# Altium project PNEV5180B_V2.0.PrjPCB
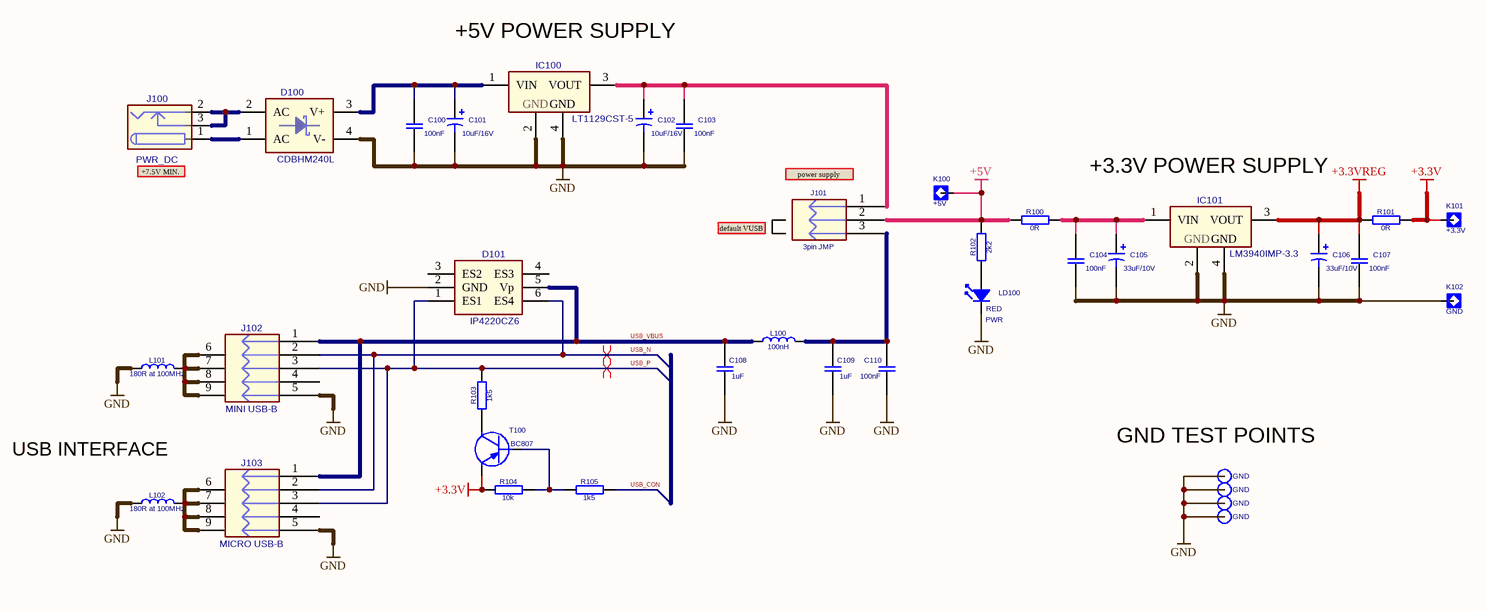
[diagram p0: Power Supply.SchDoc]
Date: 14.09.2015; Designed_by: ELTIV Bostjan Stumpfel s.p.; Revision: V2.0; Title: PNEV5180B
3 sheets, 219 parts. Net scope: global (net labels, ports and power ports of the same name join across sheets).
Board files: PNEV5180B_V2.0.PcbDoc, PNEV5180B_V2.0 - Panel.PcbDoc
Sheets:
  Power Supply.SchDoc
  Processor.SchDoc
  Reader_PN5108.SchDoc

## Sheet Power Supply.SchDoc: PNEV5180B
size A3; Date: 15.9.2015; DrawnBy: GVR; Address1: A3; Revision: 2.0; SheetNumber: 1; SheetTotal: 3

### Parts
(Parts that share a designator on the sheet are numbered #1, #2 ... from top to bottom, then left to right.)
?#1  (no value)
C100  100nF  [Y0603]
C101  10uF/16V  [CAP_TANT_1206_CASE-A]
C102  10uF/16V  [CAP_TANT_1206_CASE-A]
C103  100nF  [Y0603]
C104  100nF  [Y0603]
C105  33uF/10V  [C_TANTAL_B]
C106  33uF/10V  [C_TANTAL_B]
C107  100nF  [Y0603]
C108  1uF  [Y0603]
C109  1uF  [Y0603]
C110  100nF  [Y0603]
D100  CDBHM240L  [GRETZ_MBS2]
D101  IP4220CZ6  [SOT-457]
IC100  LT1129CST-5  [SOT-223-3]
IC101  LM3940IMP-3.3  [SOT-223-3]
J100  value PWR_DC  [CON_JCK_2.5mm]  (hidden comment: PWR_DC_PJ-202A)
J101  3pin JMP  [CON3M-LINE]
J102  MINI USB-B  [CON_USB-B-MINI_SD-67503-010_5075BMR-05-SM-CR]
J103  MICRO USB-B  [CON_USB_MICRO_B_WE-629 105 136 821]
K100  value +5V  [TESTP_ROUND_1.0mm]  (hidden comment: TP1)
K101  value +3.3V  [TESTP_ROUND_1.0mm]  (hidden comment: TP1)
K102  value GND  [TESTP_ROUND_1.0mm]  (hidden comment: TP1)
K103  value GND  [CON1_PIN_Round_1.0x1.8mm]  (hidden comment: TP_1.0mm)
K104  value GND  [CON1_PIN_Round_1.0x1.8mm]  (hidden comment: TP_1.0mm)
K105  value GND  [CON1_PIN_Round_1.0x1.8mm]  (hidden comment: TP_1.0mm)
K106  value GND  [CON1_PIN_Round_1.0x1.8mm]  (hidden comment: TP_1.0mm)
L100  100nH  [INDCC_1812]
L101  value 180R at 100MHz  [Y0603]  (hidden comment: BLM18PG181SN1)
L102  value 180R at 100MHz  [Y0603]  (hidden comment: BLM18PG181SN1)
LD100  RED  [LED_0603]
R100  0R  [Y0603]
R101  0R  [Y0603]
R102  2k2  [Y0603]
R103  1k5  [Y0603]
R104  10k  [Y0603]
R105  1k5  [Y0603]
T100  BC807  [SOT-23]

### Nets
+3.3V: K101.1 R101.1 R104.2 T100.2(E)
+3.3VREG: C106.1 C107.1 IC101.3(VOUT) R101.2
+5V: J101.2(P2) K100.1 R100.2 R102.2
GND: C100.2 C101.2 C102.2 C103.2 C104.2 C105.2 C106.2 C107.2 C108.2 C109.2 C110.2 D100.4(V-) D101.2(GND) IC100.2(GND) IC100.4(GND) IC101.2(GND) IC101.4(GND) J102.5(GND) J103.5(GND) K102.1 K103.1 K104.1 K105.1 K106.1 L101.1 L102.1 LD100.1
USB_CON: R105.1
USB_N: D101.6(ES4) J102.2(D-) J103.2(D-)
USB_P: D101.1(ES1) J102.3(D+) J103.3(D+) R103.1
USB_VBUS: C108.1 D101.5(Vp) J102.1(VBUS) J103.1(VBUS) L100.1
NetC100_1: C100.1 C101.1 D100.3(V+) IC100.1(VIN)
NetC102_1: C102.1 C103.1 IC100.3(VOUT) J101.1(P1)
NetC104_1: C104.1 C105.1 IC101.1(VIN) R100.1
NetC109_1: C109.1 C110.1 J101.3(P3) L100.2
NetD100_1: D100.1(AC) J100.1
NetD100_2: D100.2(AC) J100.2 J100.3
NetJ102_6: J102.6(Case1) J102.7(Case2) J102.8(Case3) J102.9(Case4) L101.2
NetJ103_6: J103.6(Case1) J103.7(Case2) J103.8(Case3) J103.9(Case4) L102.2
NetLD100_2: LD100.2 R102.1
NetR103_2: R103.2 T100.3(C)
NetR104_1: R104.1 R105.2 T100.1(B)

Not connected (* = marked no-connect by the designer): D101 3(ES2) 4(ES3); J102 4(ID); J103 4(ID)

### Layout directives
differential pair: USB_N, USB_P

### Notes on the sheet
- (near IC100) +5V POWER SUPPLY
- (near J100) +7.5V MIN.
- (near J101) power supply jumper
- +3.3V POWER SUPPLY
- default VUSB
- (near L102) USB INTERFACE
- GND TEST POINTS
- Title:
- Date:
- File:
- Revision:
- Drawn By:
- Sheet:
- Paper Size:
- of
- (in symbol LEDY0603) PWR

### Library data of the parts
?#1 = Title Block NXP
C100 C103 C104 C107-C110 = CAPC0603
  C100 C103 C104 C107 C110: Value: 100nF
  C108 C109: Value: 1uF
C101 C102 = C_TANTAL_1206: DNP: DNP; Value: 10uF/16V
C105 C106 = C_TANTAL_B: DNP: DNP; Value: 33uF/10V
D100 = GRETZ_MBS2: GRETZ_MBS2_Schottky; DNP: DNP; Value: CDBHM240L
D101 = D_IP4220CZ6: Value: IP4220CZ6
IC100 = LM3940-3.3: also for: LT1129IST-5; DNP: DNP; Value: LT1129CST-5
IC101 = LM3940-3.3: DNP: DNP; Value: LM3940IMP-3.3
J100 = CON_JCK_2.5mm: PWR_JACK_2.1mm x 5.5mm; DigiKey: PJ-202A; DNP: DNP
J101 = CON3M_LINE
J102 = CON_USB_B_RA: Value: 548190572 (DigiKey); Value: 675031020 (DigiKey); also for: 5075BMR-05-SM-CR (IC-Elektronika)
J103 = CON_USB_MICRO_B: Value: 629105136821 (Wurth); DNP: DNP
L100 = INDC1812: Value: 100nH
L101 L102 = INDC0603: DNP: DNP; Value: BLM18PG181SN1
LD100 = LEDY0603: Value: RED; DNP: DNP
R100-R105 = RESC0603
  R100 R101: Value: 0R
  R102: Value: 2k2
  R103 R105: Value: 1k5
  R104: Value: 10k
K103-K106 = TP_1.0mm: DNP: DNP

## Sheet Processor.SchDoc: PNEV5180B
size A3; Date: 15.9.2015; DrawnBy: GVR; Address1: A3; Revision: 2.0; SheetNumber: 2; SheetTotal: 3
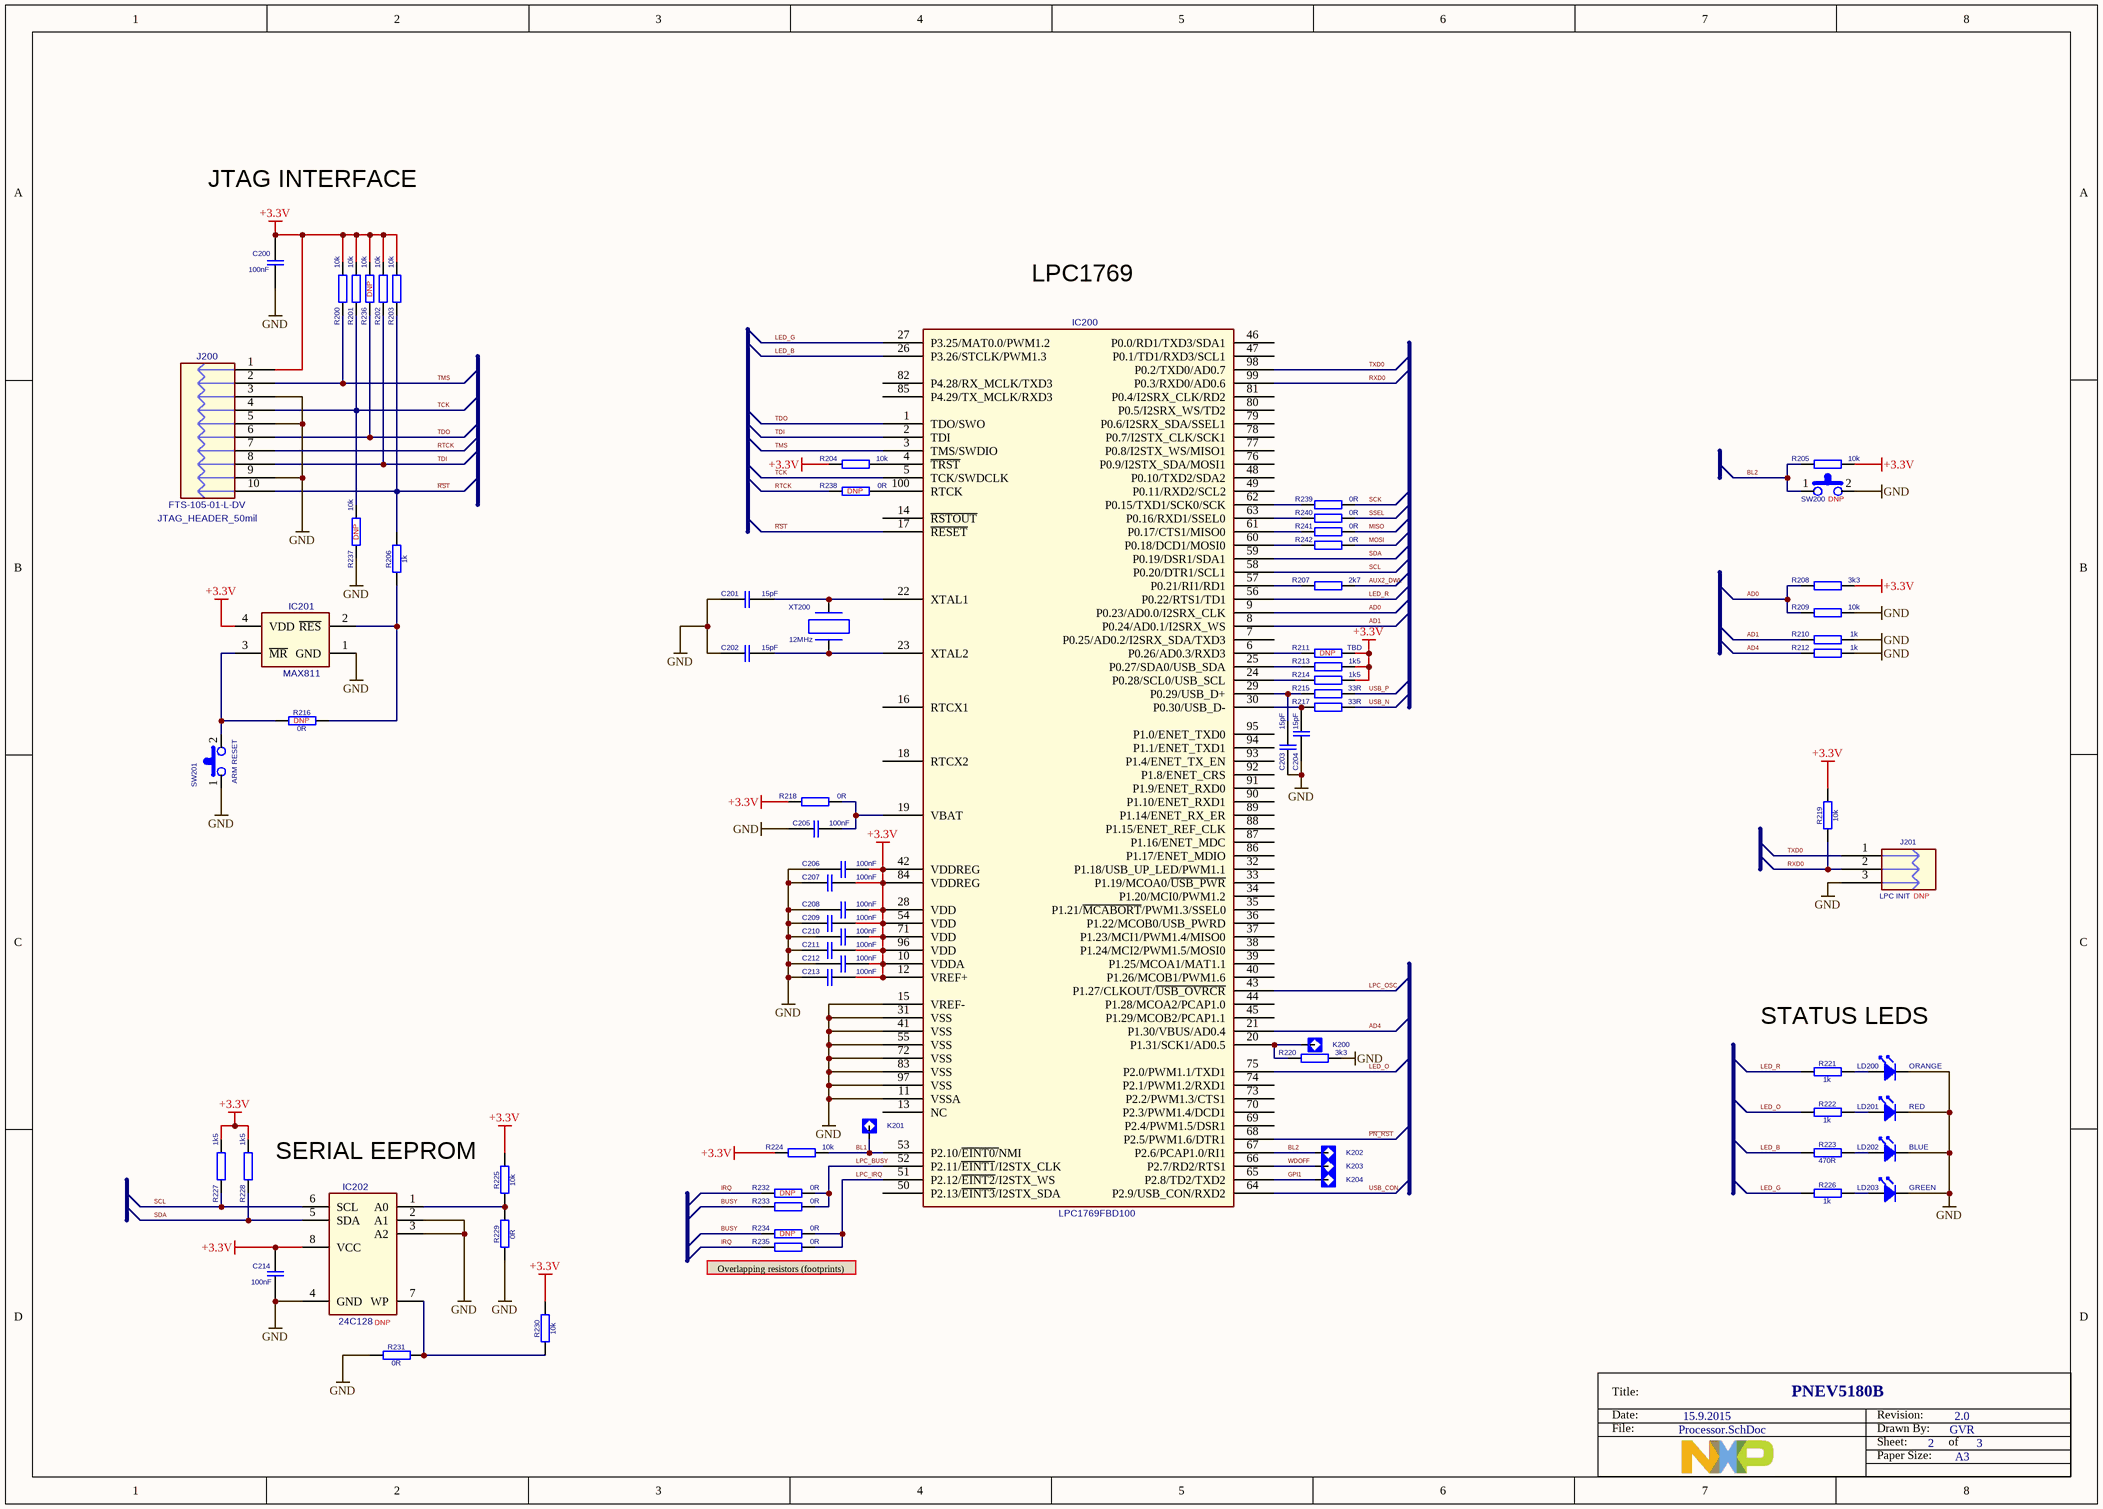
[diagram p1: Processor.SchDoc]

### Parts
(Parts that share a designator on the sheet are numbered #1, #2 ... from top to bottom, then left to right.)
?#2  (no value)
C200  100nF  [Y0603]
C201  15pF  [Y0603]
C202  15pF  [Y0603]
C203  15pF  [Y0603]
C204  15pF  [Y0603]
C205  100nF  [Y0402]
C206  100nF  [Y0402]
C207  100nF  [Y0402]
C208  100nF  [Y0402]
C209  100nF  [Y0402]
C210  100nF  [Y0402]
C211  100nF  [Y0402]
C212  100nF  [Y0402]
C213  100nF  [Y0402]
C214  100nF  [Y0603]
IC200  LPC1769FBD100  [TSQFP50P1600X1600X160-100N]
IC201  MAX811  [SOT143B]
IC202  value 24C128  [SOIC8]  (hidden comment: 24C128 DNP)
J200  FTS-105-01-L-DV  [CON_FTS-105-01-L-DV]
J201  value LPC INIT  [CON3M-LINE]  (hidden comment: LPC INIT DNP)
K200  TP1  [TESTP_ROUND_1.0mm]  (value not drawn)
K201  TP1  [TESTP_ROUND_1.0mm]  (value not drawn)
K202  TP1  [TESTP_ROUND_1.0mm]  (value not drawn)
K203  TP1  [TESTP_ROUND_1.0mm]  (value not drawn)
K204  TP1  [TESTP_ROUND_1.0mm]  (value not drawn)
LD200  ORANGE  [LED_0603]
LD201  RED  [LED_0603]
LD202  BLUE  [LED_0603]
LD203  GREEN  [LED_0603]
R200  10k  [Y0603]
R201  10k  [Y0603]
R202  10k  [Y0603]
R203  10k  [Y0603]
R204  10k  [Y0603]
R205  10k  [Y0603]
R206  1k  [Y0603]
R207  2k7  [Y0603]
R208  3k3  [Y0603]
R209  10k  [Y0603]
R210  1k  [Y0603]
R211  value TBD  [Y0603]  (hidden comment: TBD DNP)
R212  1k  [Y0603]
R213  1k5  [Y0603]
R214  1k5  [Y0603]
R215  33R  [Y0603]
R216  value 0R  [Y0603]  (hidden comment: 0R DNP)
R217  33R  [Y0603]
R218  0R  [Y0603]
R219  10k  [Y0603]
R220  3k3  [Y0603]
R221  1k  [Y0603]
R222  1k  [Y0603]
R223  470R  [Y0603]
R224  10k  [Y0603]
R225  10k  [Y0603]
R226  1k  [Y0603]
R227  1k5  [Y0603]
R228  1k5  [Y0603]
R229  0R  [Y0603]
R230  10k  [Y0603]
R231  0R  [Y0603]
R232  value 0R  [Y0805]  (hidden comment: 0R DNP)
R233  0R  [Y0805]
R234  value 0R  [Y0805]  (hidden comment: 0R DNP)
R235  0R  [Y0805]
R236  value 10k  [Y0603]  (hidden comment: 10k DNP)
R237  value 10k  [Y0603]  (hidden comment: 10k DNP)
R238  value 0R  [Y0603]  (hidden comment: 0R DNP)
R239  0R  [Y0402]
R240  0R  [Y0402]
R241  0R  [Y0402]
R242  0R  [Y0402]
SW200  DTSM-32S-B DNP  [SW_DTSM-32S-B]  (value not drawn)
SW201  DTSM-32S-B  [SW_DTSM-32S-B]  (value not drawn)
XT200  12MHz  [QUARTZ_NX5032GA]

### Nets
+3.3V: C200.1 C206.2 C207.2 C208.2 C209.2 C210.2 C211.2 C212.2 C213.2 C214.2 IC200.10(VDDA) IC200.12(VREF+) IC200.28(VDD) IC200.42(VDDREG) IC200.54(VDD) IC200.71(VDD) IC200.84(VDDREG) IC200.96(VDD) IC201.4(VDD) IC202.8(VCC) J200.1 R200.2 R201.2 R202.2 R203.2 R204.2 R205.1 R208.1 R211.1 R213.1 R214.1 R218.2 R219.2 R224.2 R225.1 R227.1 R228.1 R230.1 R236.2
GND: C200.2 C201.2 C202.2 C203.1 C204.1 C205.1 C206.1 C207.1 C208.1 C209.1 C210.1 C211.1 C212.1 C213.1 C214.1 IC200.11(VSSA) IC200.15(VREF-) IC200.31(VSS) IC200.41(VSS) IC200.55(VSS) IC200.72(VSS) IC200.83(VSS) IC200.97(VSS) IC201.1(GND) IC202.2(A1) IC202.3(A2) IC202.4(GND) J200.3 J200.5 J200.9 J201.3(P3) LD200.1 LD201.1 LD202.1 LD203.1 R209.1 R210.1 R212.1 R220.1 R229.2 R231.2 R237.1 SW200.2 SW201.1
AD0: IC200.9(P0.23/AD0.0/I2SRX_CLK) R208.2 R209.2
AD1: IC200.8(P0.24/AD0.1/I2SRX_WS) R210.2
AD4: IC200.21(P1.30/VBUS/AD0.4) R212.2
AUX2_DWL: R207.1
BL1: IC200.53(P2.10/~{EINT0/}NMI) K201.1 R224.1
BL2: IC200.67(P2.6/PCAP1.0/RI1) K202.1 R205.2 SW200.1
BUSY: R233.1 R234.1
GPI1: IC200.65(P2.8/TD2/TXD2) K204.1
IRQ: R232.1 R235.1
LED_B: IC200.26(P3.26/STCLK/PWM1.3) R223.1
LED_G: IC200.27(P3.25/MAT0.0/PWM1.2) R226.1
LED_O: IC200.75(P2.0/PWM1.1/TXD1) R222.1
LED_R: IC200.56(P0.22/RTS1/TD1) R221.1
LPC_BUSY: IC200.52(P2.11/~{EINT1}/I2STX_CLK) R232.2 R233.2
LPC_IRQ: IC200.51(P2.12/~{EINT2}/I2STX_WS) R234.2 R235.2
LPC_OSC: IC200.43(P1.27/CLKOUT/~{USB_OVRCR})
MISO: R241.1
MOSI: R242.1
~{PN_RST}: IC200.68(P2.5/PWM1.6/DTR1)
~{RST}: IC200.17(~{RESET}) J200.10 R203.1 R206.2
RTCK: J200.7 R238.2
RXD0: IC200.99(P0.3/RXD0/AD0.6) J201.2(P2) R219.1
SCK: R239.1
SCL: IC200.58(P0.20/DTR1/SCL1) IC202.6(SCL) R227.2
SDA: IC200.59(P0.19/DSR1/SDA1) IC202.5(SDA) R228.2
SSEL: R240.1
TCK: IC200.5(TCK/SWDCLK) J200.4 R201.1 R237.2
TDI: IC200.2(TDI) J200.8 R202.1
TDO: IC200.1(TDO/SWO) J200.6 R236.1
TMS: IC200.3(TMS/SWDIO) J200.2 R200.1
TXD0: IC200.98(P0.2/TXD0/AD0.7) J201.1(P1)
USB_CON: IC200.64(P2.9/USB_CON/RXD2)
USB_N: R217.1
USB_P: R215.1
WDOFF: IC200.66(P2.7/RD2/RTS1) K203.1
NetC201_1: C201.1 IC200.22(XTAL1) XT200.2
NetC202_1: C202.1 IC200.23(XTAL2) XT200.1
NetC203_2: C203.2 IC200.29(P0.29/USB_D+) R215.2
NetC204_2: C204.2 IC200.30(P0.30/USB_D-) R217.2
NetC205_2: C205.2 IC200.19(VBAT) R218.1
NetIC200_4: IC200.4(~{TRST}) R204.1
NetIC200_6: IC200.6(P0.26/AD0.3/RXD3) R211.2
NetIC200_20: IC200.20(P1.31/SCK1/AD0.5) K200.1 R220.2
NetIC200_24: IC200.24(P0.28/SCL0/USB_SCL) R214.2
NetIC200_25: IC200.25(P0.27/SDA0/USB_SDA) R213.2
NetIC200_57: IC200.57(P0.21/RI1/RD1) R207.2
NetIC200_60: IC200.60(P0.18/DCD1/MOSI0) R242.2
NetIC200_61: IC200.61(P0.17/CTS1/MISO0) R241.2
NetIC200_62: IC200.62(P0.15/TXD1/SCK0/SCK) R239.2
NetIC200_63: IC200.63(P0.16/RXD1/SSEL0) R240.2
NetIC200_100: IC200.100(RTCK) R238.1
NetIC201_2: IC201.2(~{RES}) R206.1 R216.2
NetIC201_3: IC201.3(~{MR}) R216.1 SW201.2
NetIC202_1: IC202.1(A0) R225.2 R229.1
NetIC202_7: IC202.7(WP) R230.2 R231.1
NetLD200_2: LD200.2 R221.2
NetLD201_2: LD201.2 R222.2
NetLD202_2: LD202.2 R223.2
NetLD203_2: LD203.2 R226.2

Not connected (* = marked no-connect by the designer): IC200 7(P0.25/AD0.2/I2SRX_SDA/TXD3) 13(NC) 14(~{RSTOUT}) 16(RTCX1) 18(RTCX2) 32(P1.18/USB_UP_LED/PWM1.1) 33(P1.19/MCOA0/~{USB_PWR}) 34(P1.20/MCI0/PWM1.2) 35(P1.21/~{MCABORT}/PWM1.3/SSEL0) 36(P1.22/MCOB0/USB_PWRD) 37(P1.23/MCI1/PWM1.4/MISO0) 38(P1.24/MCI2/PWM1.5/MOSI0) 39(P1.25/MCOA1/MAT1.1) 40(P1.26/MCOB1/PWM1.6) 44(P1.28/MCOA2/PCAP1.0) 45(P1.29/MCOB2/PCAP1.1) 46(P0.0/RD1/TXD3/SDA1) 47(P0.1/TD1/RXD3/SCL1) 48(P0.10/TXD2/SDA2) 49(P0.11/RXD2/SCL2) 50(P2.13/~{EINT3}/I2STX_SDA) 69(P2.4/PWM1.5/DSR1) 70(P2.3/PWM1.4/DCD1) 73(P2.2/PWM1.3/CTS1) 74(P2.1/PWM1.2/RXD1) 76(P0.9/I2STX_SDA/MOSI1) 77(P0.8/I2STX_WS/MISO1) 78(P0.7/I2STX_CLK/SCK1) 79(P0.6/I2SRX_SDA/SSEL1) 80(P0.5/I2SRX_WS/TD2) 81(P0.4/I2SRX_CLK/RD2) 82(P4.28/RX_MCLK/TXD3) 85(P4.29/TX_MCLK/RXD3) 86(P1.17/ENET_MDIO) 87(P1.16/ENET_MDC) 88(P1.15/ENET_REF_CLK) 89(P1.14/ENET_RX_ER) 90(P1.10/ENET_RXD1) 91(P1.9/ENET_RXD0) 92(P1.8/ENET_CRS) 93(P1.4/ENET_TX_EN) 94(P1.1/ENET_TXD1) 95(P1.0/ENET_TXD0)

### Notes on the sheet
- JTAG INTERFACE
- LPC1769
- STATUS LEDS
- SERIAL EEPROM
- (near R235) Overlapping resistors (footprints)
- Title:
- Date:
- File:
- Revision:
- Drawn By:
- Sheet:
- Paper Size:
- of
- (in symbol CON_JTAG_PINS) JTAG_HEADER_50mil
- (in symbol SWITCH_SMD) ARM RESET

### Library data of the parts
?#2 = Title Block NXP
C200-C204 C214 = CAPC0603
  C200 C214: Value: 100nF
  C201-C204: Value: 15pF
C205-C213 = CAPC0402: Value: 100nF
IC200 = LPC176XFBD100: LQFP100; DNP: DNP; Value: LPC1769FBD100
IC202 = 24CXX: SERIAL EEPROM; DNP: DNP
J200 = CON_JTAG_PINS: 50mil, 2x5 pin (M), SMD; DNP: DNP; Value: FTS-105-01-L-DV
J201 = CON3M_LINE: DNP: DNP
LD200-LD203 = LEDY0603: DNP: DNP
  LD200: Value: ORANGE
  LD201: Value: RED
  LD202: Value: BLUE
  LD203: Value: GREEN
R200-R231 R236-R238 = RESC0603
  R200-R205 R209 R219 R224 R225 R230: Value: 10k
  R206 R210 R212 R221 R222 R226: Value: 1k
  R207: Value: 2k7; DNP: DNP
  R208 R220: Value: 3k3
  R211 R216 R236-R238: DNP: DNP
  R213 R214 R227 R228: Value: 1k5
  R215 R217: Value: 33R
  R218 R231: Value: 0R
  R223: Value: 470R
  R229: DNP: DNP; Value: 0R
R232-R235 = RESC0805: DNP: DNP
  R233 R235: Value: 0R
R239-R242 = RESC0402: Value: 0R; DNP: DNP
SW200 = SWITCH_SMD: DTSM-32S-B; DNP: DNP; Value: DTSM-32S-B
SW201 = SWITCH_SMD: DNP: DNP; Value: DTSM-32S-B
XT200 = QUARTZ_NX5032: Value: 12MHz

## Sheet Reader_PN5108.SchDoc: PNEV5180B
size A3; Date: 15.9.2015; DrawnBy: GVR; Address1: A3; Revision: 2.0; SheetNumber: 3; SheetTotal: 3
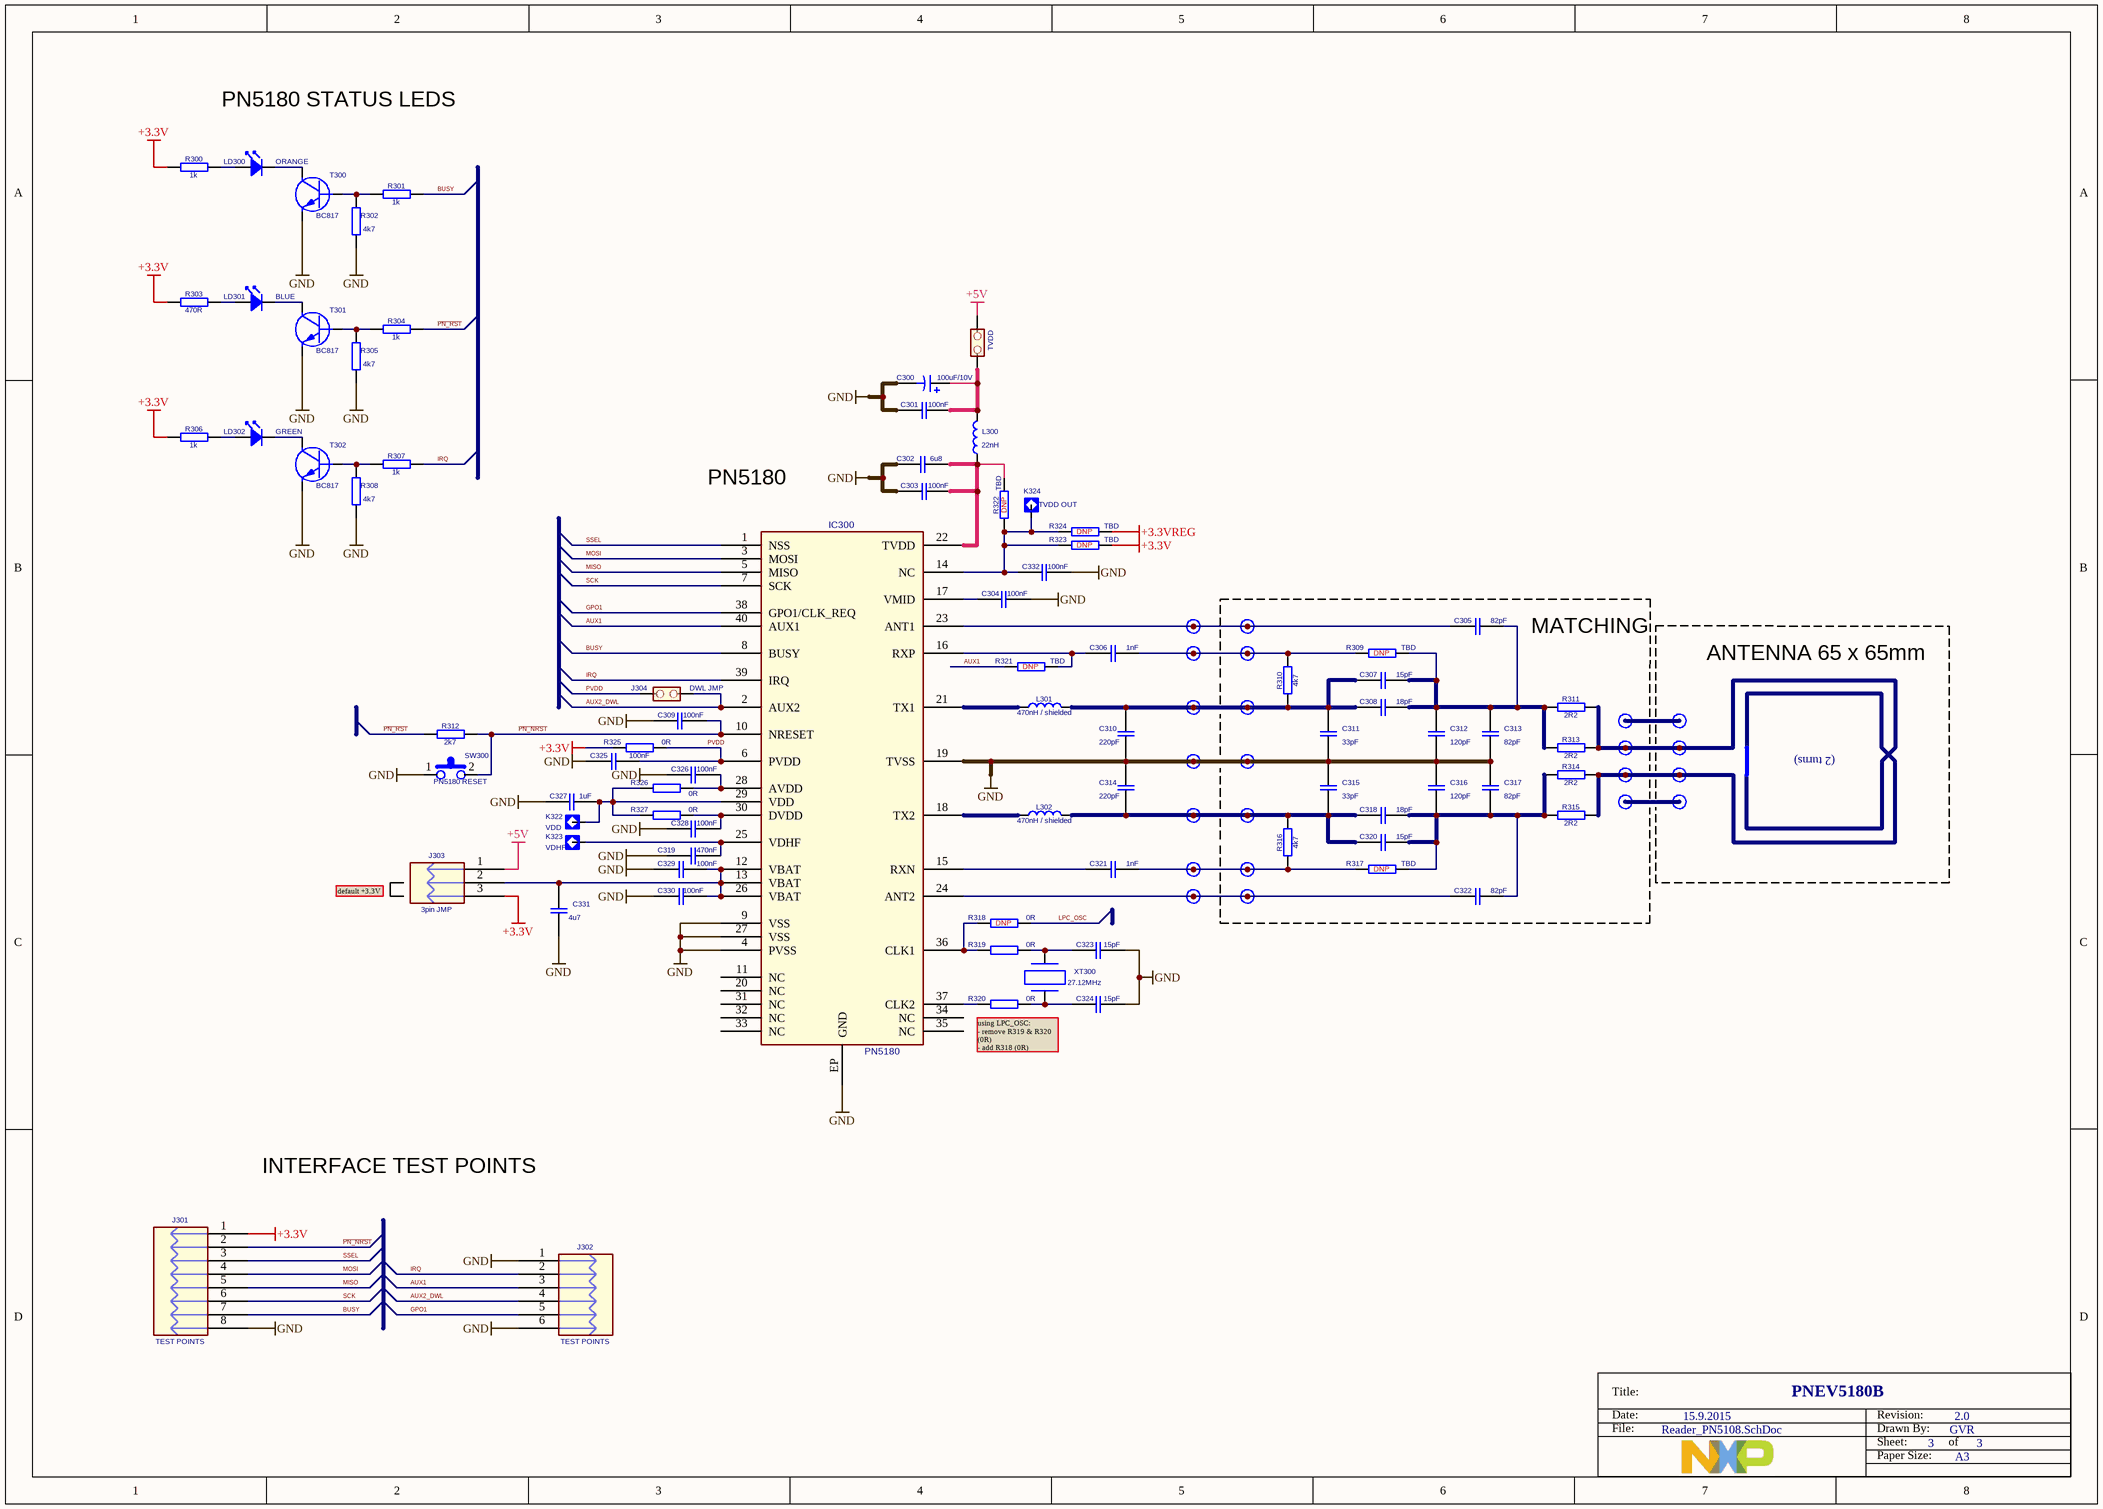
[diagram p2: Reader_PN5108.SchDoc]

### Parts
(Parts that share a designator on the sheet are numbered #1, #2 ... from top to bottom, then left to right.)
?#3  (no value)
C300  100uF/10V  [C_TANTAL_B]
C301  100nF  [Y0603]
C302  6u8  [Y0603]
C303  100nF  [Y0603]
C304  100nF  [Y0603]
C305  82pF  [Y0805]
C306  1nF  [Y0805]
C307  15pF  [Y0805]
C308  18pF  [Y0805]
C309  100nF  [Y0603]
C310  220pF  [Y0805]
C311  33pF  [Y0805]
C312  120pF  [Y0805]
C313  82pF  [Y0805]
C314  220pF  [Y0805]
C315  33pF  [Y0805]
C316  120pF  [Y0805]
C317  82pF  [Y0805]
C318  18pF  [Y0805]
C319  470nF  [Y0603]
C320  15pF  [Y0805]
C321  1nF  [Y0805]
C322  82pF  [Y0805]
C323  15pF  [Y0603]
C324  15pF  [Y0603]
C325  100nF  [Y0402]
C326  100nF  [Y0603]
C327  1uF  [Y0603]
C328  100nF  [Y0603]
C329  100nF  [Y0402]
C330  100nF  [Y0402]
C331  4u7  [Y0603]
C332  100nF  [Y0603]
IC300  PN5180  [QFN50P600X600X100_HS-41N]
J300  TVDD  [CON2]
J301  value TEST POINTS  [CON8M-LINE]  (hidden comment: CON8M_LINE)
J302  value TEST POINTS  [CON6M-LINE]  (hidden comment: CON6M_LINE)
J303  3pin JMP  [CON3M-LINE]
J304  DWL JMP  [CON2]
K300  TP_1.0mm  [CON1_PIN_Round_1.0x1.8mm]  (value not drawn)
K301  TP_1.0mm  [CON1_PIN_Round_1.0x1.8mm]  (value not drawn)
K302  TP_1.0mm  [CON1_PIN_Round_1.0x1.8mm]  (value not drawn)
K303  TP_1.0mm  [CON1_PIN_Round_1.0x1.8mm]  (value not drawn)
K304  TP_1.0mm  [CON1_PIN_Round_1.0x1.8mm]  (value not drawn)
K305  TP_1.0mm  [CON1_PIN_Round_1.0x1.8mm]  (value not drawn)
K306  TP_1.0mm  [CON1_PIN_Round_1.0x1.8mm]  (value not drawn)
K307  TP_1.0mm  [CON1_PIN_Round_1.0x1.8mm]  (value not drawn)
K308  TP_1.0mm  [CON1_PIN_Round_1.0x1.8mm]  (value not drawn)
K309  TP_1.0mm  [CON1_PIN_Round_1.0x1.8mm]  (value not drawn)
K310  TP_1.0mm  [CON1_PIN_Round_1.0x1.8mm]  (value not drawn)
K311  TP_1.0mm  [CON1_PIN_Round_1.0x1.8mm]  (value not drawn)
K312  TP_1.0mm  [CON1_PIN_Round_1.0x1.8mm]  (value not drawn)
K313  TP_1.0mm  [CON1_PIN_Round_1.0x1.8mm]  (value not drawn)
K314  TP_1.0mm  [CON1_PIN_Round_1.0x1.8mm]  (value not drawn)
K315  TP_1.0mm  [CON1_PIN_Round_1.0x1.8mm]  (value not drawn)
K316  TP_1.0mm  [CON1_PIN_Round_1.0x1.8mm]  (value not drawn)
K317  TP_1.0mm  [CON1_PIN_Round_1.0x1.8mm]  (value not drawn)
K318  TP_1.0mm  [CON1_PIN_Round_1.0x1.8mm]  (value not drawn)
K319  TP_1.0mm  [CON1_PIN_Round_1.0x1.8mm]  (value not drawn)
K320  TP_1.0mm  [CON1_PIN_Round_1.0x1.8mm]  (value not drawn)
K321  TP_1.0mm  [CON1_PIN_Round_1.0x1.8mm]  (value not drawn)
K322  value VDD  [TESTP_ROUND_1.0mm]  (hidden comment: TP1)
K323  value VDHF  [TESTP_ROUND_1.0mm]  (hidden comment: TP1)
K324  value TVDD OUT  [TESTP_ROUND_1.0mm]  (hidden comment: TP1)
L300  22nH  [Y0805]
L301  value 470nH / shielded  [INDCC_1812_1210]  (hidden comment: 470nH / shielded (1210))
L302  value 470nH / shielded  [INDCC_1812_1210]  (hidden comment: 470nH / shielded (1210))
LD300  ORANGE  [LED_0603]
LD301  BLUE  [LED_0603]
LD302  GREEN  [LED_0603]
NT1  Net_Tie  [Net_Tie_SMT_0.406mm]  (value not drawn)  (net tie, no BOM)
R300  1k  [Y0603]
R301  1k  [Y0603]
R302  4k7  [Y0603]
R303  470R  [Y0603]
R304  1k  [Y0603]
R305  4k7  [Y0603]
R306  1k  [Y0603]
R307  1k  [Y0603]
R308  4k7  [Y0603]
R309  value TBD  [Y0805]  (hidden comment: TBD DNP)
R310  4k7  [Y0805]
R311  2R2  [Y0805]
R312  2k7  [Y0603]
R313  2R2  [Y0805]
R314  2R2  [Y0805]
R315  2R2  [Y0805]
R316  4k7  [Y0805]
R317  value TBD  [Y0805]  (hidden comment: TBD DNP)
R318  value 0R  [Y0603]  (hidden comment: 0R DNP)
R319  0R  [Y0603]
R320  0R  [Y0603]
R321  value TBD  [Y0603]  (hidden comment: TBD DNP)
R322  value TBD  [Y0603]  (hidden comment: TBD DNP)
R323  value TBD  [Y0603]  (hidden comment: TBD DNP)
R324  value TBD  [Y0603]  (hidden comment: TBD DNP)
R325  0R  [Y0603]
R326  0R  [Y0603]
R327  0R  [Y0603]
SW300  DTSM-32S-B  [SW_DTSM-32S-B]  (value not drawn)
T300  BC817  [SOT-23]
T301  BC817  [SOT-23]
T302  BC817  [SOT-23]
XT300  27.12MHz  [QUARTZ_32SMX]

### Nets
+3.3V: J301.1(P1) J303.3(P3) R300.2 R303.2 R306.2 R323.1 R325.2
+3.3VREG: R324.1
+5V: J300.2 J303.1(P1)
GND: C300.2 C301.1 C302.2 C303.1 C304.1 C309.2 C310.1 C311.1 C312.1 C313.1 C314.2 C315.2 C316.2 C317.2 C319.2 C323.1 C324.1 C325.1 C326.2 C327.2 C328.2 C329.1 C330.1 C331.2 C332.1 IC300.4(PVSS) IC300.9(VSS) IC300.19(TVSS) IC300.27(VSS) IC300.EP(GND) J301.8(P8) J302.1(P1) J302.6(P6) K310.1 K311.1 R302.2 R305.2 R308.2 SW300.1 T300.2(E) T301.2(E) T302.2(E)
AUX1: IC300.40(AUX1) J302.3(P3) R321.2
AUX2_DWL: IC300.2(AUX2) J302.4(P4) J304.2
BUSY: IC300.8(BUSY) J301.7(P7) R301.2
GPO1: IC300.38(GPO1/CLK_REQ) J302.5(P5)
IRQ: IC300.39(IRQ) J302.2(P2) R307.2
LPC_OSC: R318.1
MISO: IC300.5(MISO) J301.5(P5)
MOSI: IC300.3(MOSI) J301.4(P4)
~{PN_NRST}: C309.1 IC300.10(NRESET) J301.2(P2) R312.2 SW300.2
~{PN_RST}: R304.2 R312.1
PVDD: C325.2 IC300.6(PVDD) J304.1 R325.1
SCK: IC300.7(SCK) J301.6(P6)
SSEL: IC300.1(NSS) J301.3(P3)
NetC300_1: C300.1 C301.2 J300.1 L300.2
NetC302_1: C302.1 C303.2 IC300.22(TVDD) L300.1 R322.1
NetC304_2: C304.2 IC300.17(VMID)
NetC305_1: C305.1 IC300.23(ANT1) K300.1 K301.1
NetC305_2: C305.2 C307.2 C308.2 C312.2 C313.2 R309.1 R311.2 R313.2
NetC306_1: C306.1 IC300.16(RXP) R321.1
NetC306_2: C306.2 K302.1 K303.1 R309.2 R310.1
NetC307_1: C307.1 C308.1 C310.2 C311.2 K304.1 K305.1 L301.2 R310.2
NetC314_1: C314.1 C315.1 C318.1 C320.1 K316.1 K317.1 L302.2 R316.1
NetC316_1: C316.1 C317.1 C318.2 C320.2 C322.2 R314.2 R315.2 R317.1
NetC319_1: C319.1 IC300.25(VDHF) K323.1
NetC321_1: C321.1 IC300.15(RXN)
NetC321_2: C321.2 K318.1 K319.1 R316.2 R317.2
NetC322_1: C322.1 IC300.24(ANT2) K320.1 K321.1
NetC323_2: C323.2 R319.1 XT300.3
NetC324_2: C324.2 R320.1 XT300.1
NetC326_1: C326.1 IC300.28(AVDD) R326.1
NetC327_1: C327.1 IC300.29(VDD) K322.1 R326.2 R327.2
NetC328_1: C328.1 IC300.30(DVDD) R327.1
NetC329_2: C329.2 C330.2 C331.1 IC300.12(VBAT) IC300.13(VBAT) IC300.26(VBAT) J303.2(P2)
NetC332_2: C332.2 IC300.14(NC) K324.1 R322.2 R323.2 R324.2
NetIC300_18: IC300.18(TX2) L302.1
NetIC300_21: IC300.21(TX1) L301.1
NetIC300_36: IC300.36(CLK1) R318.2 R319.2
NetIC300_37: IC300.37(CLK2) R320.2
NetK306_1: K306.1 K307.1
NetK308_1: K308.1 K309.1 NT1.1 R311.1 R313.1
NetK312_1: K312.1 K313.1 NT1.2 R314.1 R315.1
NetK314_1: K314.1 K315.1
NetLD300_1: LD300.1 T300.3(C)
NetLD300_2: LD300.2 R300.1
NetLD301_1: LD301.1 T301.3(C)
NetLD301_2: LD301.2 R303.1
NetLD302_1: LD302.1 T302.3(C)
NetLD302_2: LD302.2 R306.1
NetR301_1: R301.1 R302.1 T300.1(B)
NetR304_1: R304.1 R305.1 T301.1(B)
NetR307_1: R307.1 R308.1 T302.1(B)

Not connected (* = marked no-connect by the designer): IC300 11(NC) 20(NC) 31(NC) 32(NC) 33(NC) 34(NC) 35(NC); XT300 2 4

### Notes on the sheet
- PN5180 STATUS LEDS
- PN5180
- MATCHING
- ANTENNA 65 x 65mm
- (near NT1) (2 turns)
- default +3.3V
- (near R320) using LPC_OSC:
  - remove R319 & R320 (0R)
  - add R318 (0R)
- INTERFACE TEST POINTS
- Title:
- Date:
- File:
- Revision:
- Drawn By:
- Sheet:
- Paper Size:
- of
- (in symbol SWITCH_SMD) PN5180 RESET

### Library data of the parts
?#3 = Title Block NXP
C300 = C_TANTAL_B: DNP: DNP; Value: 100uF/10V
C301-C304 C309 C319 C323 C324 C326-C328 C331 C332 = CAPC0603
  C301 C303 C304 C309 C326 C328 C332: Value: 100nF
  C302: Value: 6u8
  C319: Value: 470nF
  C323 C324: Value: 15pF
  C327: Value: 1uF
  C331: Value: 4u7
C305-C308 C310-C318 C320-C322 = CAPC0805
  C305 C313 C317 C322: Value: 82pF
  C306 C321: Value: 1nF
  C307 C320: Value: 15pF
  C308 C318: Value: 18pF
  C310 C314: Value: 220pF
  C311 C315: Value: 33pF
  C312 C316: Value: 120pF
C325 C329 C330 = CAPC0402: Value: 100nF
IC300 = PN5180: 13.56 MHz Reader; DNP: DNP; Value: PN5180
J300 J304 = JMP2: DNP: DNP
J303 = CON3M_LINE
K300-K321 = TP_1.0mm: Value: {Value}; DNP: DNP
L300 = INDC0805: Value: 22nH
L301 L302 = INDC1812
LD300-LD302 = LEDY0603: DNP: DNP
  LD300: Value: ORANGE
  LD301: Value: BLUE
  LD302: Value: GREEN
NT1 = Net_Tie: Component for shorting nets in design
R300-R308 R312 R318-R327 = RESC0603
  R300 R301 R304 R306 R307: Value: 1k
  R302 R305 R308: Value: 4k7
  R303: Value: 470R
  R312: Value: 2k7
  R318 R321-R324: DNP: DNP
  R319 R320 R325-R327: Value: 0R
R309-R311 R313-R317 = RESC0805
  R309 R317: DNP: DNP
  R310 R316: Value: 4k7; DNP: DNP
  R311 R313-R315: Value: 2R2
SW300 = SWITCH_SMD: DNP: DNP; Value: DTSM-32S-B
XT300 = QUARTZ_32SMX: Value: 27.12MHz
J301 = CON8M_LINE: DNP: DNP
J302 = CON6M_LINE: DNP: DNP

## Nets that join several sheets
+3.3V: Power Supply (K101.1 R101.1 R104.2 T100.2), Processor (39 pins), Reader_PN5108 (7 pins)
+3.3VREG: Power Supply (C106.1 C107.1 IC101.3 R101.2), Reader_PN5108 (R324.1)
+5V: Power Supply (J101.2 K100.1 R100.2 R102.2), Reader_PN5108 (J300.2 J303.1)
GND: Power Supply (27 pins), Processor (44 pins), Reader_PN5108 (42 pins)
AUX2_DWL: Processor (R207.1), Reader_PN5108 (IC300.2 J302.4 J304.2)
BUSY: Processor (R233.1 R234.1), Reader_PN5108 (IC300.8 J301.7 R301.2)
IRQ: Processor (R232.1 R235.1), Reader_PN5108 (IC300.39 J302.2 R307.2)
LPC_OSC: Processor (IC200.43), Reader_PN5108 (R318.1)
MISO: Processor (R241.1), Reader_PN5108 (IC300.5 J301.5)
MOSI: Processor (R242.1), Reader_PN5108 (IC300.3 J301.4)
~{PN_RST}: Processor (IC200.68), Reader_PN5108 (R304.2 R312.1)
SCK: Processor (R239.1), Reader_PN5108 (IC300.7 J301.6)
SSEL: Processor (R240.1), Reader_PN5108 (IC300.1 J301.3)
USB_CON: Power Supply (R105.1), Processor (IC200.64)
USB_N: Power Supply (D101.6 J102.2 J103.2), Processor (R217.1)
USB_P: Power Supply (D101.1 J102.3 J103.3 R103.1), Processor (R215.1)